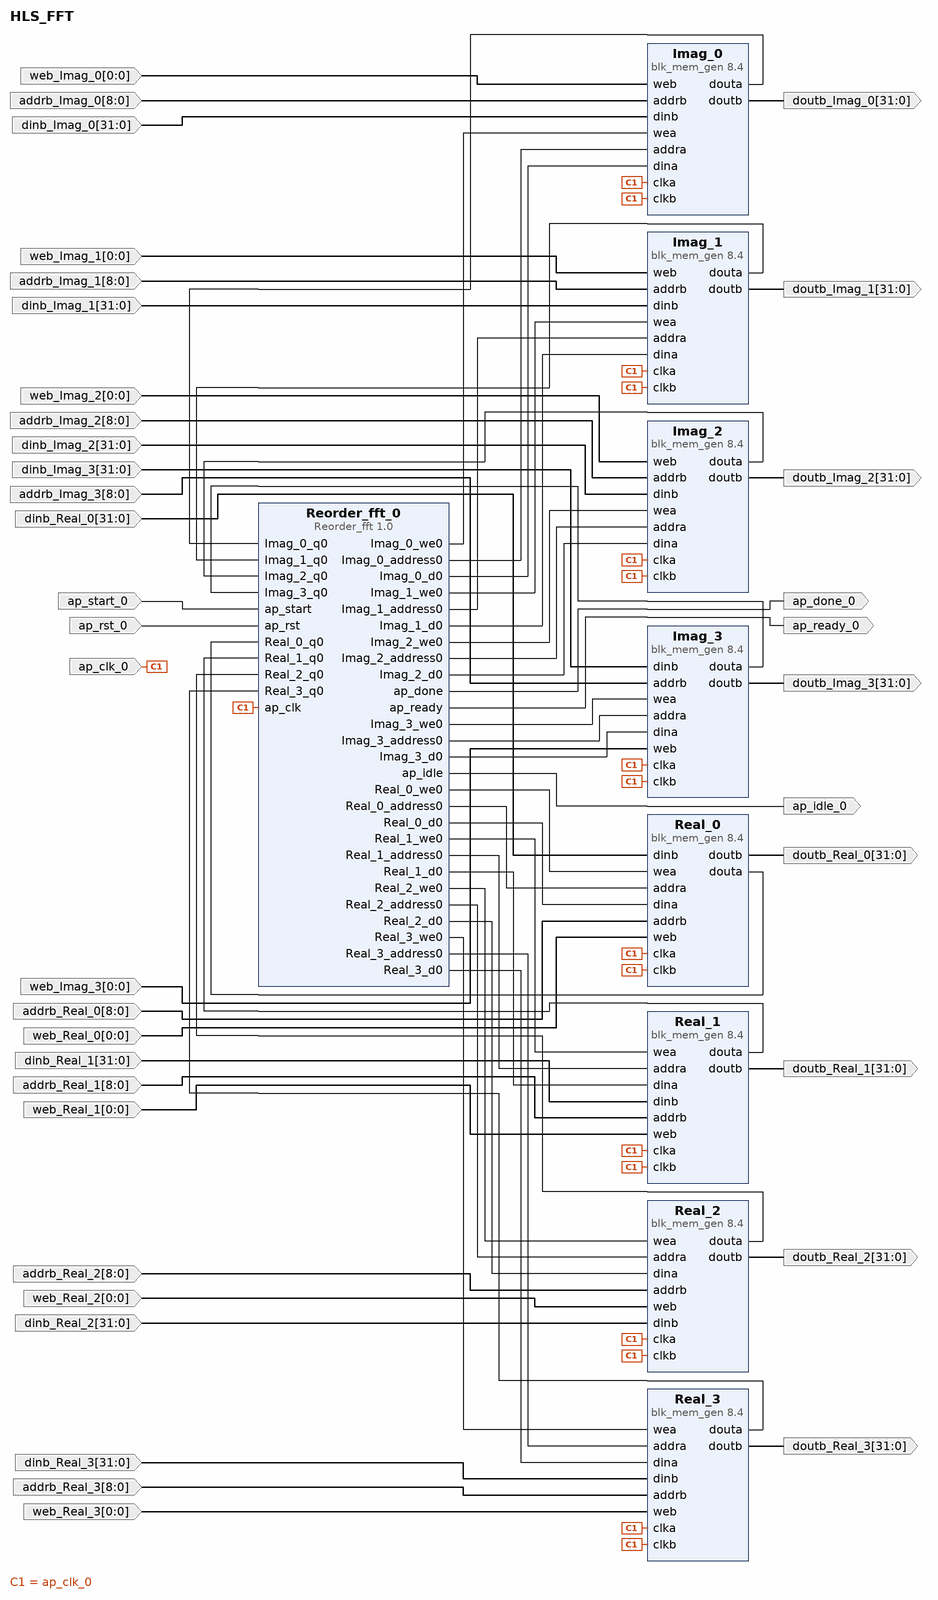
[diagram p0: block diagram of the top level]
# Vivado block design HLS_FFT, xc7z045ffg900-2, Vivado 2018.3
create_bd_design HLS_FFT

create_bd_port -dir I ap_start_0
create_bd_port -dir I -type clk ap_clk_0
create_bd_port -dir O ap_ready_0
create_bd_port -dir O ap_done_0
create_bd_port -dir O ap_idle_0
create_bd_port -dir I -type rst ap_rst_0
set_property -dict {CONFIG.POLARITY ACTIVE_HIGH} [get_bd_ports ap_rst_0]
create_bd_port -dir I -from 8 -to 0 addrb_Real_2
create_bd_port -dir I -from 31 -to 0 dinb_Real_1
create_bd_port -dir O -from 31 -to 0 doutb_Real_3
create_bd_port -dir I -from 8 -to 0 addrb_Real_1
create_bd_port -dir I -from 31 -to 0 dinb_Real_0
create_bd_port -dir I -from 0 -to 0 web_Real_2
create_bd_port -dir O -from 31 -to 0 doutb_Real_2
create_bd_port -dir I -from 8 -to 0 addrb_Real_0
create_bd_port -dir I -from 0 -to 0 web_Real_1
create_bd_port -dir O -from 31 -to 0 doutb_Real_1
create_bd_port -dir I -from 0 -to 0 web_Real_0
create_bd_port -dir O -from 31 -to 0 doutb_Real_0
create_bd_port -dir I -from 0 -to 0 web_Imag_2
create_bd_port -dir I -from 31 -to 0 dinb_Imag_3
create_bd_port -dir O -from 31 -to 0 doutb_Imag_3
create_bd_port -dir I -from 8 -to 0 addrb_Imag_3
create_bd_port -dir O -from 31 -to 0 doutb_Imag_2
create_bd_port -dir I -from 8 -to 0 addrb_Imag_2
create_bd_port -dir I -from 0 -to 0 web_Imag_1
create_bd_port -dir I -from 0 -to 0 web_Imag_0
create_bd_port -dir O -from 31 -to 0 doutb_Imag_1
create_bd_port -dir I -from 8 -to 0 addrb_Imag_1
create_bd_port -dir I -from 31 -to 0 dinb_Imag_2
create_bd_port -dir I -from 0 -to 0 web_Imag_3
create_bd_port -dir I -from 31 -to 0 dinb_Imag_1
create_bd_port -dir O -from 31 -to 0 doutb_Imag_0
create_bd_port -dir I -from 8 -to 0 addrb_Imag_0
create_bd_port -dir I -from 31 -to 0 dinb_Imag_0
create_bd_port -dir I -from 31 -to 0 dinb_Real_3
create_bd_port -dir I -from 8 -to 0 addrb_Real_3
create_bd_port -dir I -from 31 -to 0 dinb_Real_2
create_bd_port -dir I -from 0 -to 0 web_Real_3

create_bd_cell -type ip -vlnv xilinx.com:ip:blk_mem_gen:8.4 Real_0
set_property -dict [list \
  CONFIG.Assume_Synchronous_Clk true \
  CONFIG.Enable_32bit_Address false \
  CONFIG.Enable_A Always_Enabled \
  CONFIG.Enable_B Use_ENB_Pin \
  CONFIG.Fill_Remaining_Memory_Locations true \
  CONFIG.Memory_Type True_Dual_Port_RAM \
  CONFIG.Port_B_Clock 100 \
  CONFIG.Port_B_Enable_Rate 100 \
  CONFIG.Port_B_Write_Rate 50 \
  CONFIG.Read_Width_A 32 \
  CONFIG.Read_Width_B 32 \
  CONFIG.Register_PortA_Output_of_Memory_Primitives true \
  CONFIG.Register_PortB_Output_of_Memory_Primitives true \
  CONFIG.Remaining_Memory_Locations 40400000 \
  CONFIG.Use_Byte_Write_Enable false \
  CONFIG.Use_RSTA_Pin false \
  CONFIG.Use_RSTB_Pin false \
  CONFIG.Write_Depth_A 257 \
  CONFIG.Write_Width_A 32 \
  CONFIG.Write_Width_B 32 \
  CONFIG.use_bram_block Stand_Alone \
] [get_bd_cells Real_0]
create_bd_cell -type ip -vlnv xilinx.com:hls:Reorder_fft:1.0 Reorder_fft_0
create_bd_cell -type ip -vlnv xilinx.com:ip:blk_mem_gen:8.4 Real_1
set_property -dict [list \
  CONFIG.Enable_32bit_Address false \
  CONFIG.Enable_A Always_Enabled \
  CONFIG.Enable_B Always_Enabled \
  CONFIG.Fill_Remaining_Memory_Locations true \
  CONFIG.Memory_Type True_Dual_Port_RAM \
  CONFIG.Port_B_Clock 100 \
  CONFIG.Port_B_Enable_Rate 100 \
  CONFIG.Port_B_Write_Rate 50 \
  CONFIG.Register_PortA_Output_of_Memory_Primitives true \
  CONFIG.Register_PortB_Output_of_Memory_Primitives true \
  CONFIG.Remaining_Memory_Locations 40400000 \
  CONFIG.Use_Byte_Write_Enable false \
  CONFIG.Use_RSTA_Pin false \
  CONFIG.Use_RSTB_Pin false \
  CONFIG.Write_Depth_A 257 \
  CONFIG.use_bram_block Stand_Alone \
] [get_bd_cells Real_1]
create_bd_cell -type ip -vlnv xilinx.com:ip:blk_mem_gen:8.4 Real_2
set_property -dict [list \
  CONFIG.Enable_32bit_Address false \
  CONFIG.Enable_A Always_Enabled \
  CONFIG.Enable_B Always_Enabled \
  CONFIG.Fill_Remaining_Memory_Locations true \
  CONFIG.Memory_Type True_Dual_Port_RAM \
  CONFIG.Port_B_Clock 100 \
  CONFIG.Port_B_Enable_Rate 100 \
  CONFIG.Port_B_Write_Rate 50 \
  CONFIG.Register_PortA_Output_of_Memory_Primitives true \
  CONFIG.Register_PortB_Output_of_Memory_Primitives true \
  CONFIG.Remaining_Memory_Locations 40400000 \
  CONFIG.Use_Byte_Write_Enable false \
  CONFIG.Use_RSTA_Pin false \
  CONFIG.Use_RSTB_Pin false \
  CONFIG.Write_Depth_A 257 \
  CONFIG.use_bram_block Stand_Alone \
] [get_bd_cells Real_2]
create_bd_cell -type ip -vlnv xilinx.com:ip:blk_mem_gen:8.4 Real_3
set_property -dict [list \
  CONFIG.Enable_32bit_Address false \
  CONFIG.Enable_A Always_Enabled \
  CONFIG.Enable_B Always_Enabled \
  CONFIG.Fill_Remaining_Memory_Locations true \
  CONFIG.Memory_Type True_Dual_Port_RAM \
  CONFIG.Port_B_Clock 100 \
  CONFIG.Port_B_Enable_Rate 100 \
  CONFIG.Port_B_Write_Rate 50 \
  CONFIG.Register_PortA_Output_of_Memory_Primitives true \
  CONFIG.Register_PortB_Output_of_Memory_Primitives true \
  CONFIG.Remaining_Memory_Locations 40400000 \
  CONFIG.Use_Byte_Write_Enable false \
  CONFIG.Use_RSTA_Pin false \
  CONFIG.Use_RSTB_Pin false \
  CONFIG.Write_Depth_A 257 \
  CONFIG.use_bram_block Stand_Alone \
] [get_bd_cells Real_3]
create_bd_cell -type ip -vlnv xilinx.com:ip:blk_mem_gen:8.4 Imag_0
set_property -dict [list \
  CONFIG.Assume_Synchronous_Clk true \
  CONFIG.Enable_32bit_Address false \
  CONFIG.Enable_A Always_Enabled \
  CONFIG.Enable_B Always_Enabled \
  CONFIG.Fill_Remaining_Memory_Locations true \
  CONFIG.Load_Init_File false \
  CONFIG.Memory_Type True_Dual_Port_RAM \
  CONFIG.Port_B_Clock 100 \
  CONFIG.Port_B_Enable_Rate 100 \
  CONFIG.Port_B_Write_Rate 50 \
  CONFIG.Register_PortA_Output_of_Memory_Primitives true \
  CONFIG.Register_PortB_Output_of_Memory_Primitives true \
  CONFIG.Remaining_Memory_Locations 40400000 \
  CONFIG.Use_Byte_Write_Enable false \
  CONFIG.Use_RSTA_Pin false \
  CONFIG.Use_RSTB_Pin false \
  CONFIG.Write_Depth_A 257 \
  CONFIG.use_bram_block Stand_Alone \
] [get_bd_cells Imag_0]
create_bd_cell -type ip -vlnv xilinx.com:ip:blk_mem_gen:8.4 Imag_1
set_property -dict [list \
  CONFIG.Assume_Synchronous_Clk true \
  CONFIG.Enable_32bit_Address false \
  CONFIG.Enable_A Always_Enabled \
  CONFIG.Enable_B Always_Enabled \
  CONFIG.Fill_Remaining_Memory_Locations true \
  CONFIG.Load_Init_File false \
  CONFIG.Memory_Type True_Dual_Port_RAM \
  CONFIG.Port_B_Clock 100 \
  CONFIG.Port_B_Enable_Rate 100 \
  CONFIG.Port_B_Write_Rate 50 \
  CONFIG.Register_PortA_Output_of_Memory_Primitives true \
  CONFIG.Register_PortB_Output_of_Memory_Primitives true \
  CONFIG.Remaining_Memory_Locations 40400000 \
  CONFIG.Use_Byte_Write_Enable false \
  CONFIG.Use_RSTA_Pin false \
  CONFIG.Use_RSTB_Pin false \
  CONFIG.Write_Depth_A 257 \
  CONFIG.use_bram_block Stand_Alone \
] [get_bd_cells Imag_1]
create_bd_cell -type ip -vlnv xilinx.com:ip:blk_mem_gen:8.4 Imag_2
set_property -dict [list \
  CONFIG.Assume_Synchronous_Clk true \
  CONFIG.Enable_32bit_Address false \
  CONFIG.Enable_A Always_Enabled \
  CONFIG.Enable_B Always_Enabled \
  CONFIG.Fill_Remaining_Memory_Locations true \
  CONFIG.Load_Init_File false \
  CONFIG.Memory_Type True_Dual_Port_RAM \
  CONFIG.Port_B_Clock 100 \
  CONFIG.Port_B_Enable_Rate 100 \
  CONFIG.Port_B_Write_Rate 50 \
  CONFIG.Register_PortA_Output_of_Memory_Primitives true \
  CONFIG.Register_PortB_Output_of_Memory_Primitives true \
  CONFIG.Remaining_Memory_Locations 40400000 \
  CONFIG.Use_Byte_Write_Enable false \
  CONFIG.Use_RSTA_Pin false \
  CONFIG.Use_RSTB_Pin false \
  CONFIG.Write_Depth_A 257 \
  CONFIG.use_bram_block Stand_Alone \
] [get_bd_cells Imag_2]
create_bd_cell -type ip -vlnv xilinx.com:ip:blk_mem_gen:8.4 Imag_3
set_property -dict [list \
  CONFIG.Assume_Synchronous_Clk true \
  CONFIG.Enable_32bit_Address false \
  CONFIG.Enable_A Always_Enabled \
  CONFIG.Enable_B Always_Enabled \
  CONFIG.Fill_Remaining_Memory_Locations true \
  CONFIG.Memory_Type True_Dual_Port_RAM \
  CONFIG.Port_B_Clock 100 \
  CONFIG.Port_B_Enable_Rate 100 \
  CONFIG.Port_B_Write_Rate 50 \
  CONFIG.Register_PortA_Output_of_Memory_Primitives true \
  CONFIG.Register_PortB_Output_of_Memory_Primitives true \
  CONFIG.Remaining_Memory_Locations 40400000 \
  CONFIG.Use_Byte_Write_Enable false \
  CONFIG.Use_RSTA_Pin false \
  CONFIG.Use_RSTB_Pin false \
  CONFIG.Write_Depth_A 257 \
  CONFIG.use_bram_block Stand_Alone \
] [get_bd_cells Imag_3]

# ---- connections ----

connect_bd_net -net ap_start_0_1 [get_bd_ports ap_start_0] [get_bd_pins Reorder_fft_0/ap_start]
connect_bd_net -net ap_clk_0_1 [get_bd_ports ap_clk_0] \
  [get_bd_pins Reorder_fft_0/ap_clk] [get_bd_pins Real_3/clkb] [get_bd_pins Real_2/clkb] [get_bd_pins Real_3/clka] \
  [get_bd_pins Real_2/clka] [get_bd_pins Real_1/clka] [get_bd_pins Real_1/clkb] [get_bd_pins Real_0/clka] \
  [get_bd_pins Real_0/clkb] [get_bd_pins Imag_0/clka] [get_bd_pins Imag_0/clkb] [get_bd_pins Imag_1/clkb] \
  [get_bd_pins Imag_1/clka] [get_bd_pins Imag_2/clka] [get_bd_pins Imag_2/clkb] [get_bd_pins Imag_3/clkb] \
  [get_bd_pins Imag_3/clka]
connect_bd_net [get_bd_pins Reorder_fft_0/ap_ready] [get_bd_ports ap_ready_0]
connect_bd_net [get_bd_pins Reorder_fft_0/ap_done] [get_bd_ports ap_done_0]
connect_bd_net [get_bd_pins Reorder_fft_0/ap_idle] [get_bd_ports ap_idle_0]
connect_bd_net -net ap_rst_0_1 [get_bd_ports ap_rst_0] [get_bd_pins Reorder_fft_0/ap_rst]
connect_bd_net [get_bd_pins Reorder_fft_0/Real_0_we0] [get_bd_pins Real_0/wea]
connect_bd_net [get_bd_pins Reorder_fft_0/Real_1_we0] [get_bd_pins Real_1/wea]
connect_bd_net [get_bd_pins Reorder_fft_0/Real_2_we0] [get_bd_pins Real_2/wea]
connect_bd_net [get_bd_pins Reorder_fft_0/Real_3_we0] [get_bd_pins Real_3/wea]
connect_bd_net [get_bd_pins Reorder_fft_0/Real_2_address0] [get_bd_pins Real_2/addra]
connect_bd_net [get_bd_pins Reorder_fft_0/Real_2_d0] [get_bd_pins Real_2/dina]
connect_bd_net [get_bd_pins Reorder_fft_0/Real_3_address0] [get_bd_pins Real_3/addra]
connect_bd_net [get_bd_pins Reorder_fft_0/Real_3_d0] [get_bd_pins Real_3/dina]
connect_bd_net [get_bd_pins Real_3/douta] [get_bd_pins Reorder_fft_0/Real_3_q0]
connect_bd_net [get_bd_pins Real_2/douta] [get_bd_pins Reorder_fft_0/Real_2_q0]
connect_bd_net [get_bd_pins Real_1/douta] [get_bd_pins Reorder_fft_0/Real_1_q0]
connect_bd_net [get_bd_pins Real_0/douta] [get_bd_pins Reorder_fft_0/Real_0_q0]
connect_bd_net [get_bd_pins Reorder_fft_0/Real_1_address0] [get_bd_pins Real_1/addra]
connect_bd_net [get_bd_pins Reorder_fft_0/Real_1_d0] [get_bd_pins Real_1/dina]
connect_bd_net [get_bd_pins Reorder_fft_0/Imag_0_we0] [get_bd_pins Imag_0/wea]
connect_bd_net [get_bd_pins Reorder_fft_0/Imag_1_we0] [get_bd_pins Imag_1/wea]
connect_bd_net [get_bd_pins Reorder_fft_0/Imag_2_we0] [get_bd_pins Imag_2/wea]
connect_bd_net [get_bd_pins Reorder_fft_0/Imag_3_we0] [get_bd_pins Imag_3/wea]
connect_bd_net [get_bd_pins Reorder_fft_0/Imag_0_address0] [get_bd_pins Imag_0/addra]
connect_bd_net [get_bd_pins Reorder_fft_0/Imag_0_d0] [get_bd_pins Imag_0/dina]
connect_bd_net [get_bd_pins Reorder_fft_0/Imag_1_address0] [get_bd_pins Imag_1/addra]
connect_bd_net [get_bd_pins Reorder_fft_0/Imag_1_d0] [get_bd_pins Imag_1/dina]
connect_bd_net [get_bd_pins Reorder_fft_0/Imag_2_address0] [get_bd_pins Imag_2/addra]
connect_bd_net [get_bd_pins Reorder_fft_0/Imag_2_d0] [get_bd_pins Imag_2/dina]
connect_bd_net [get_bd_pins Reorder_fft_0/Imag_3_address0] [get_bd_pins Imag_3/addra]
connect_bd_net [get_bd_pins Reorder_fft_0/Imag_3_d0] [get_bd_pins Imag_3/dina]
connect_bd_net [get_bd_pins Imag_0/douta] [get_bd_pins Reorder_fft_0/Imag_0_q0]
connect_bd_net [get_bd_pins Imag_1/douta] [get_bd_pins Reorder_fft_0/Imag_1_q0]
connect_bd_net [get_bd_pins Imag_2/douta] [get_bd_pins Reorder_fft_0/Imag_2_q0]
connect_bd_net [get_bd_pins Imag_3/douta] [get_bd_pins Reorder_fft_0/Imag_3_q0]
connect_bd_net [get_bd_pins Reorder_fft_0/Real_0_address0] [get_bd_pins Real_0/addra]
connect_bd_net [get_bd_pins Reorder_fft_0/Real_0_d0] [get_bd_pins Real_0/dina]
connect_bd_net -net addrb_0_1 [get_bd_ports addrb_Real_2] [get_bd_pins Real_2/addrb]
connect_bd_net -net dinb_0_1 [get_bd_ports dinb_Real_1] [get_bd_pins Real_1/dinb]
connect_bd_net [get_bd_pins Real_3/doutb] [get_bd_ports doutb_Real_3]
connect_bd_net -net addrb_1_1 [get_bd_ports addrb_Real_1] [get_bd_pins Real_1/addrb]
connect_bd_net -net dinb_1_1 [get_bd_ports dinb_Real_0] [get_bd_pins Real_0/dinb]
connect_bd_net -net web_0_1 [get_bd_ports web_Real_2] [get_bd_pins Real_2/web]
connect_bd_net [get_bd_pins Real_2/doutb] [get_bd_ports doutb_Real_2]
connect_bd_net -net addrb_2_1 [get_bd_ports addrb_Real_0] [get_bd_pins Real_0/addrb]
connect_bd_net -net web_1_1 [get_bd_ports web_Real_1] [get_bd_pins Real_1/web]
connect_bd_net [get_bd_pins Real_1/doutb] [get_bd_ports doutb_Real_1]
connect_bd_net -net web_2_1 [get_bd_ports web_Real_0] [get_bd_pins Real_0/web]
connect_bd_net [get_bd_pins Real_0/doutb] [get_bd_ports doutb_Real_0]
connect_bd_net -net web_3_1 [get_bd_ports web_Imag_2] [get_bd_pins Imag_2/web]
connect_bd_net -net dinb_2_1 [get_bd_ports dinb_Imag_3] [get_bd_pins Imag_3/dinb]
connect_bd_net [get_bd_pins Imag_3/doutb] [get_bd_ports doutb_Imag_3]
connect_bd_net -net addrb_3_1 [get_bd_ports addrb_Imag_3] [get_bd_pins Imag_3/addrb]
connect_bd_net [get_bd_pins Imag_2/doutb] [get_bd_ports doutb_Imag_2]
connect_bd_net -net addrb_4_1 [get_bd_ports addrb_Imag_2] [get_bd_pins Imag_2/addrb]
connect_bd_net -net web_4_1 [get_bd_ports web_Imag_1] [get_bd_pins Imag_1/web]
connect_bd_net -net web_5_1 [get_bd_ports web_Imag_0] [get_bd_pins Imag_0/web]
connect_bd_net [get_bd_pins Imag_1/doutb] [get_bd_ports doutb_Imag_1]
connect_bd_net -net addrb_5_1 [get_bd_ports addrb_Imag_1] [get_bd_pins Imag_1/addrb]
connect_bd_net -net dinb_3_1 [get_bd_ports dinb_Imag_2] [get_bd_pins Imag_2/dinb]
connect_bd_net -net web_6_1 [get_bd_ports web_Imag_3] [get_bd_pins Imag_3/web]
connect_bd_net -net dinb_4_1 [get_bd_ports dinb_Imag_1] [get_bd_pins Imag_1/dinb]
connect_bd_net [get_bd_pins Imag_0/doutb] [get_bd_ports doutb_Imag_0]
connect_bd_net -net addrb_6_1 [get_bd_ports addrb_Imag_0] [get_bd_pins Imag_0/addrb]
connect_bd_net -net dinb_5_1 [get_bd_ports dinb_Imag_0] [get_bd_pins Imag_0/dinb]
connect_bd_net -net dinb_6_1 [get_bd_ports dinb_Real_3] [get_bd_pins Real_3/dinb]
connect_bd_net -net addrb_7_1 [get_bd_ports addrb_Real_3] [get_bd_pins Real_3/addrb]
connect_bd_net -net dinb_7_1 [get_bd_ports dinb_Real_2] [get_bd_pins Real_2/dinb]
connect_bd_net -net web_7_1 [get_bd_ports web_Real_3] [get_bd_pins Real_3/web]

validate_bd_design
save_bd_design
